# Altium project STM32F030F4P6_3.PrjPcb
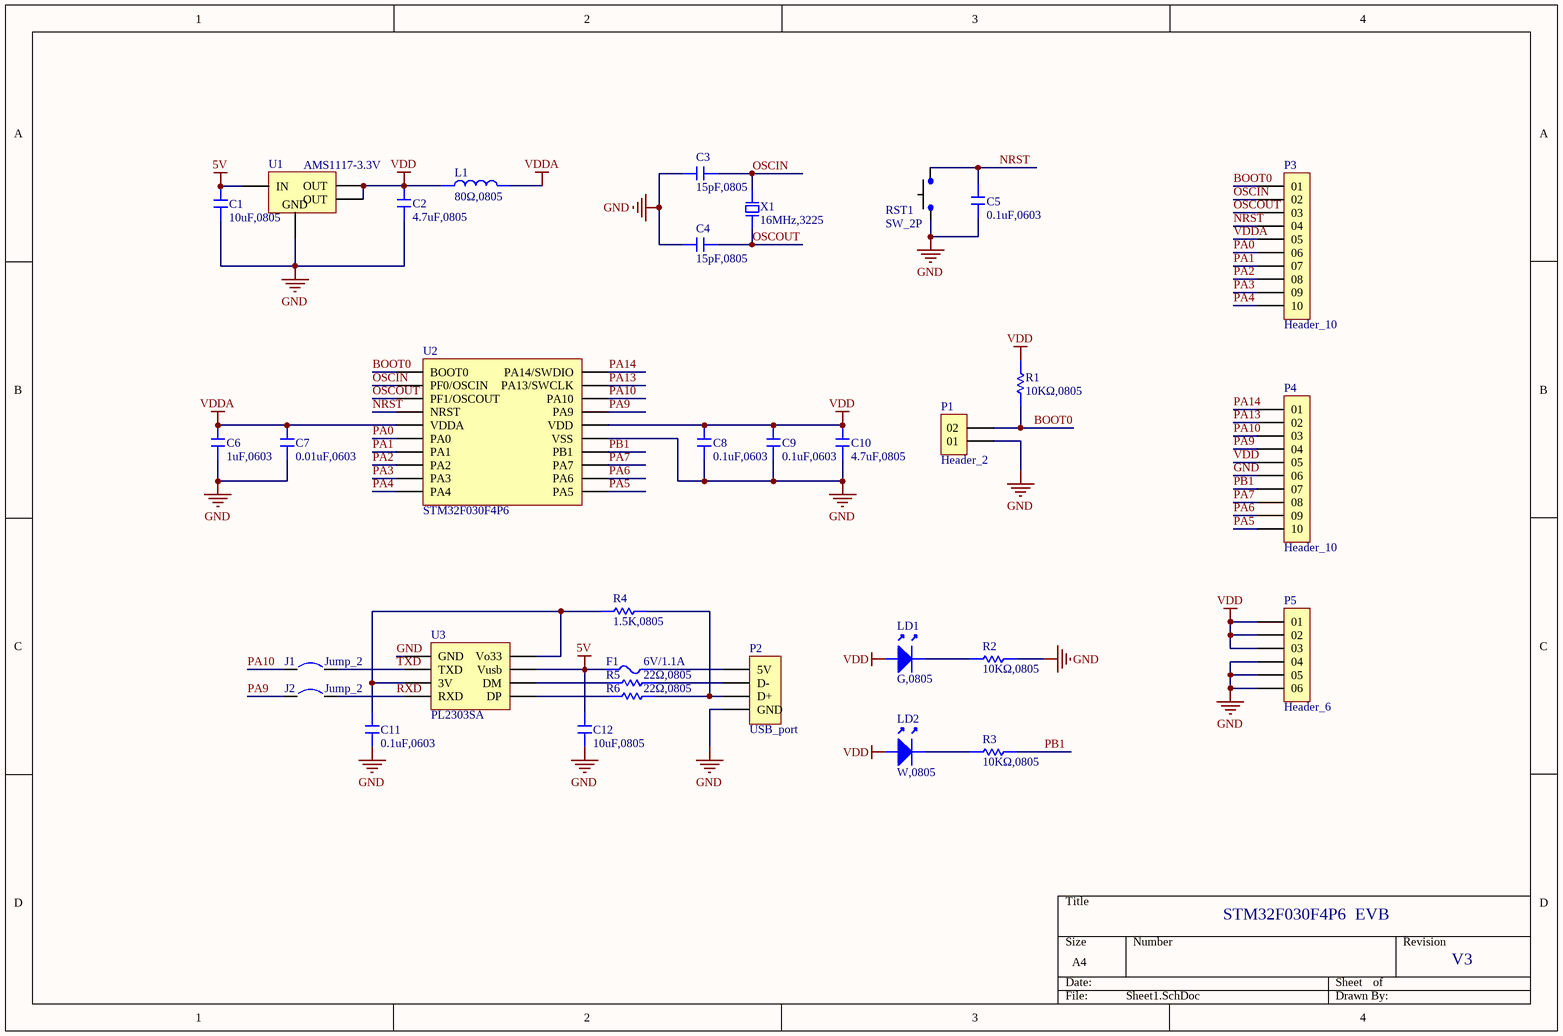
[diagram p0: Sheet1.SchDoc]
1 sheet, 34 parts. Net scope: global (net labels, ports and power ports of the same name join across sheets).
Board files: PCB1.PcbDoc, PCB_B.PcbDoc

## Sheet Sheet1.SchDoc
size A4

### Parts
C1  10uF,0805  [C0805]
C2  4.7uF,0805  [C0805]
C3  15pF,0805  [C0805]
C4  15pF,0805  [C0805]
C5  0.1uF,0603  [C0603]
C6  1uF,0603  [C0603]
C7  0.01uF,0603  [C0603]
C8  0.1uF,0603  [C0603]
C9  0.1uF,0603  [C0603]
C10  4.7uF,0805  [C0805]
C11  0.1uF,0603  [C0603]
C12  10uF,0805  [C0805]
F1  6V/1.1A  [F0805]
J1  Jump_2  [Jp0603]
J2  Jump_2  [Jp0603]
L1  80Ω,0805  [L0805]
LD1  G,0805  [LED0805]
LD2  W,0805  [LED0805]
P1  Header_2  [Header_2]
P2  USB_port  [USB-AO]
P3  Header_10  [Header_10]
P4  Header_10  [Header_10]
P5  Header_6  [Header_6]
R1  10KΩ,0805  [R0805]
R2  10KΩ,0805  [R0805]
R3  10KΩ,0805  [R0805]
R4  1.5K,0805  [R0805]
R5  22Ω,0805  [R0805]
R6  22Ω,0805  [R0805]
RST1  SW_2P  [SW_2P_3]
U1  AMS1117-3.3V  [SOT-223]
U2  STM32F030F4P6  [TSSOP20]
U3  PL2303SA  [SOP8]
X1  16MHz,3225  [XTAL_SMD_3225]

### Nets
5V: C1.01 C12.01 F1.01 U1.03(IN) U3.07(Vusb)
GND: C1.02 C2.02 C3.01 C4.02 C5.02 C6.02 C7.02 C8.02 C9.02 C10.02 C11.02 C12.02 P1.01 P2.01(GND) P4.06 P5.04 P5.05 P5.06 R2.01 RST1.01 U1.01(GND) U2.15(VSS) U3.01(GND)
VDD: C2.01 C8.01 C9.01 C10.01 L1.01 LD1.01 LD2.01 P4.05 P5.01 P5.02 P5.03 R1.02 U1.02(OUT) U1.04(OUT) U2.16(VDD)
VDDA: C6.01 C7.01 L1.02 P3.05 U2.05(VDDA)
BOOT0: P1.02 P3.01 R1.01 U2.01(BOOT0)
NRST: C5.01 P3.04 RST1.02 U2.04(NRST)
OSCIN: C3.02 P3.02 U2.02(PF0/OSCIN) X1.02
OSCOUT: C4.01 P3.03 U2.03(PF1/OSCOUT) X1.01
PA0: P3.06 U2.06(PA0)
PA1: P3.07 U2.07(PA1)
PA2: P3.08 U2.08(PA2)
PA3: P3.09 U2.09(PA3)
PA4: P3.10 U2.10(PA4)
PA5: P4.10 U2.11(PA5)
PA6: P4.09 U2.12(PA6)
PA7: P4.08 U2.13(PA7)
PA9: J2.01 P4.04 U2.17(PA9)
PA10: J1.01 P4.03 U2.18(PA10)
PA13: P4.02 U2.19(PA13/SWCLK)
PA14: P4.01 U2.20(PA14/SWDIO)
PB1: P4.07 R3.01 U2.14(PB1)
RXD: J2.02 U3.04(RXD)
TXD: J1.02 U3.02(TXD)
NetC11_01: C11.01 R4.01 U3.03(3V) U3.08(Vo33)
NetF1_02: F1.02 P2.04(5V)
NetLD1_02: LD1.02 R2.02
NetLD2_02: LD2.02 R3.02
NetP2_02: P2.02(D+) R4.02 R6.02
NetP2_03: P2.03(D-) R5.02
NetR5_01: R5.01 U3.06(DM)
NetR6_01: R6.01 U3.05(DP)

### Notes on the sheet
- STM32F030F4P6  EVB
- V3

### Library data of the parts
C1-C12 = Cap
F1 = Fuse
L1 = Ind
LD1 LD2 = Diode - LED
R1-R6 = Res
U1 = AMS1117
X1 = XTAL